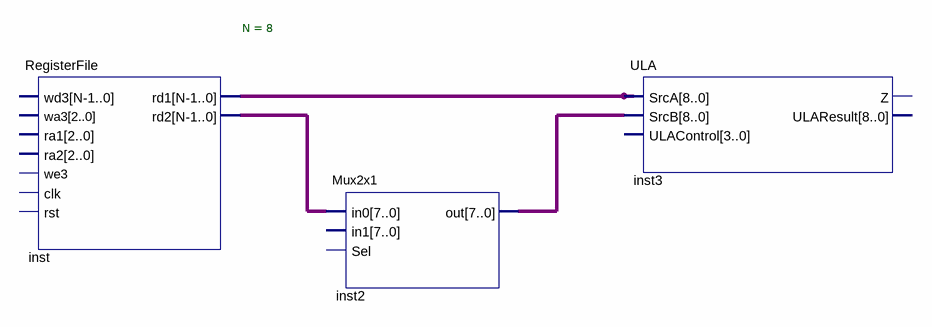
[diagram p0: schematic sheet]
// Quartus schematic SPRINT4.bdf as structural Verilog: 3 symbols, 0 pins
module SPRINT4 (
);

  wire [7:0] inst_rd2;
  wire [8:0] inst2_out, inst_rd1;

  RegisterFile #(.N(8)) inst (.rd1(inst_rd1), .rd2(inst_rd2));  // open: wd3, wa3, ra1, ra2, we3, clk, rst
  Mux2x1 inst2 (.in0(inst_rd2), .out(inst2_out));  // open: in1, Sel
  ULA inst3 (.SrcA(inst_rd1), .SrcB(inst2_out));  // open: ULAControl, Z, ULAResult
endmodule
